# Altium schematic sheet SeccionMicrocontrolador.SchDoc
size A4
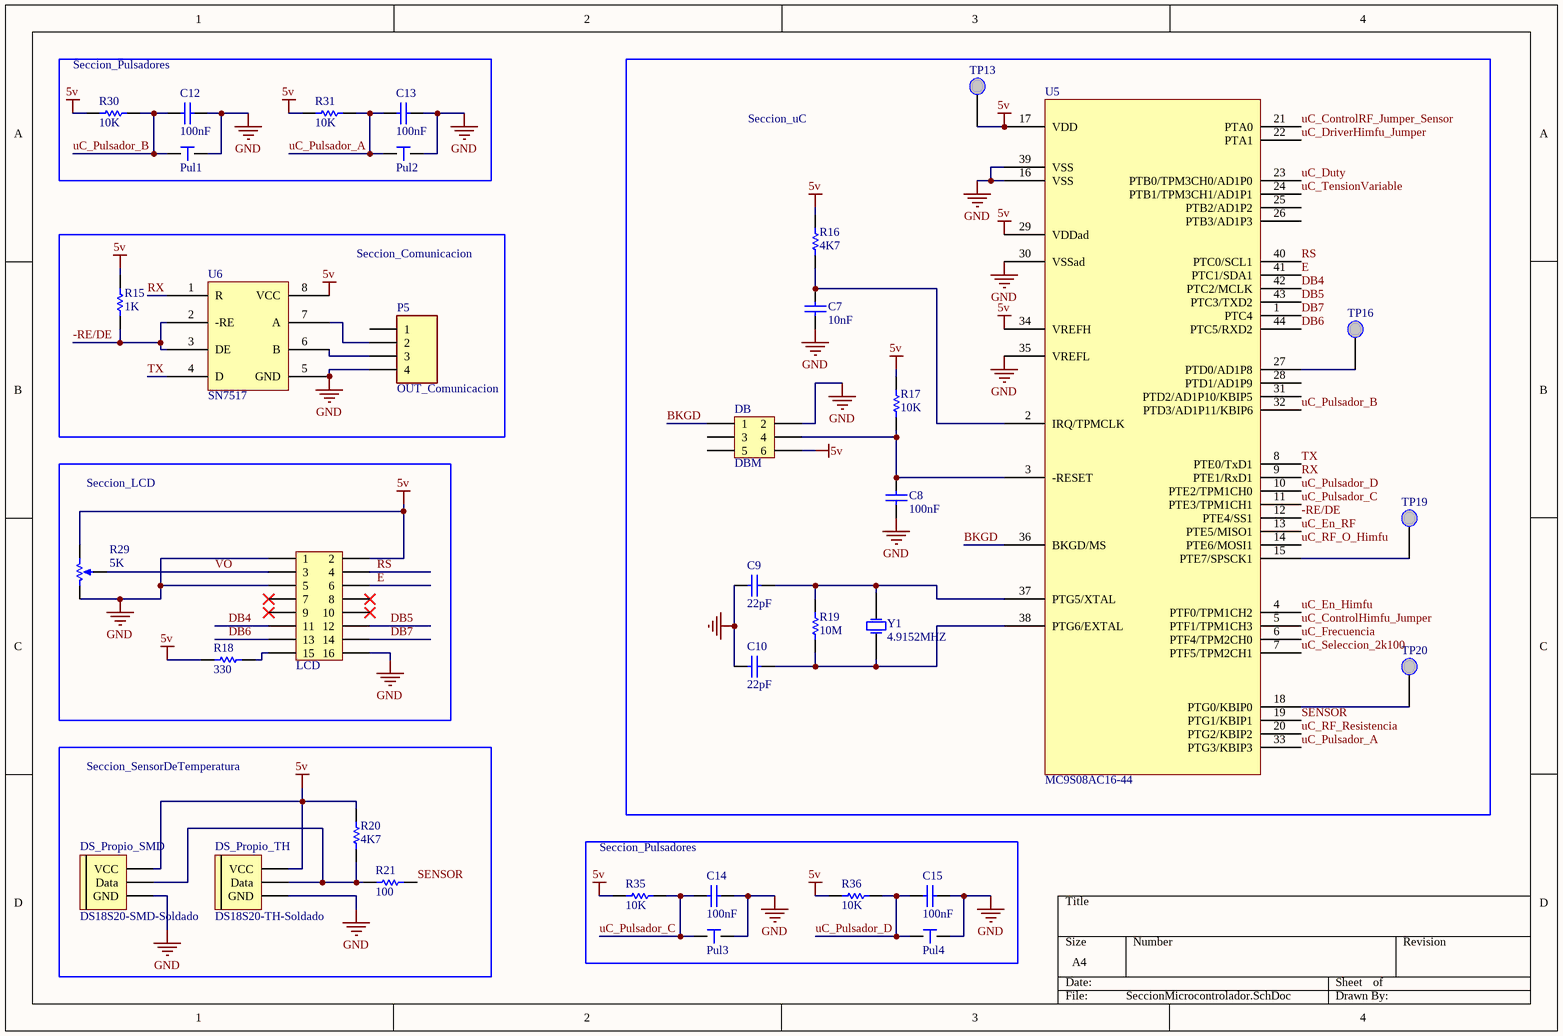
[diagram p0: SeccionMicrocontrolador.SchDoc]

## Parts
C7  10nF  [C_0805]
C8  100nF  [C_0805]
C9  22pF  [C_0805]
C10  22pF  [C_0805]
C12  100nF  [C_0805]
C13  100nF  [C_0805]
C14  100nF  [C_0805]
C15  100nF  [C_0805]
DB  DBM  [DBM]
DS_Propio_SMD  DS18S20-SMD-Soldado  [SOIC8]
DS_Propio_TH  DS18S20-TH-Soldado  [TO92]
LCD  LCD_Pines  [LCD_Pines]  (value not drawn)
P5  OUT_Comunicacion  [B4B-XH-A_3D]
Pul1  PinesParaPulsador  [Jumper-Simple]  (value not drawn)
Pul2  PinesParaPulsador  [Jumper-Simple]  (value not drawn)
Pul3  PinesParaPulsador  [Jumper-Simple]  (value not drawn)
Pul4  PinesParaPulsador  [Jumper-Simple]  (value not drawn)
R15  1K  [R_0805]
R16  4K7  [R_0805]
R17  10K  [R_0805]
R18  330  [R_0805]
R19  10M  [R_0805]
R20  4K7  [R_0805]
R21  100  [R_0805]
R29  5K  [Preset_SMD]
R30  10K  [R_0805]
R31  10K  [R_0805]
R35  10K  [R_0805]
R36  10K  [R_0805]
TP13  5V  [TP-5002]  (value not drawn)
TP16  PTD0  [TP-5002]  (value not drawn)
TP19  PTE7  [TP-5002]  (value not drawn)
TP20  PTG0  [TP-5002]  (value not drawn)
U5  MC9S08AC16-44  [QFP10x10-G44/Z14.4N]
U6  SN7517  [751-07_N]
Y1  4.9152MHZ  [XTAL_LOW]

## Blocks framed on the sheet
Seccion_Pulsadores: C12 C13 Pul1 Pul2 R30 R31
Seccion_uC: C7-C10 DB R16 R17 R19 TP13 TP16 TP19 TP20 U5 Y1
Seccion_Comunicacion: P5 R15 U6
Seccion_LCD: LCD R18 R29
Seccion_SensorDeTemperatura: DS_Propio_SMD DS_Propio_TH R20 R21
Seccion_Pulsadores: C14 C15 Pul3 Pul4 R35 R36

## Nets
5v: DB.6 DS_Propio_SMD.3(VCC) DS_Propio_TH.3(VCC) LCD.2 R15.2 R16.2 R17.2 R18.1 R20.2 R29.1(TOP_CCW) R30.2 R31.2 R35.2 R36.2 TP13.1 U5.17(VDD) U5.29(VDDad) U5.34(VREFH) U6.8(VCC)
GND: C7.1 C8.1 C9.1 C10.1 C12.1 C13.1 C14.1 C15.1 DB.2 DS_Propio_SMD.5(GND) DS_Propio_TH.1(GND) LCD.1 LCD.5 LCD.16 P5.4 Pul1.1 Pul2.1 Pul3.1 Pul4.1 R29.3(BOT_CW) U5.16(VSS) U5.30(VSSad) U5.35(VREFL) U5.39(VSS) U6.5(GND)
-RE/DE: R15.1 U5.12(PTE4/SS1) U6.2(-RE) U6.3(DE)
BKGD: DB.1 U5.36(BKGD/MS)
DB4: LCD.11 U5.42(PTC2/MCLK)
DB5: LCD.12 U5.43(PTC3/TXD2)
DB6: LCD.13 U5.44(PTC5/RXD2)
DB7: LCD.14 U5.1(PTC4)
E: LCD.6 U5.41(PTC1/SDA1)
RS: LCD.4 U5.40(PTC0/SCL1)
RX: U5.9(PTE1/RxD1) U6.1(R)
SENSOR: R21.2 U5.19(PTG1/KBIP1)
TX: U5.8(PTE0/TxD1) U6.4(D)
uC_ControlHimfu_Jumper: U5.5(PTF1/TPM1CH3)
uC_ControlRF_Jumper_Sensor: U5.21(PTA0)
uC_DriverHimfu_Jumper: U5.22(PTA1)
uC_Duty: U5.23(PTB0/TPM3CH0/AD1P0)
uC_En_Himfu: U5.4(PTF0/TPM1CH2)
uC_En_RF: U5.13(PTE5/MISO1)
uC_Frecuencia: U5.6(PTF4/TPM2CH0)
uC_Pulsador_A: C13.2 Pul2.2 R31.1 U5.33(PTG3/KBIP3)
uC_Pulsador_B: C12.2 Pul1.2 R30.1 U5.32(PTD3/AD1P11/KBIP6)
uC_Pulsador_C: C14.2 Pul3.2 R35.1 U5.11(PTE3/TPM1CH1)
uC_Pulsador_D: C15.2 Pul4.2 R36.1 U5.10(PTE2/TPM1CH0)
uC_RF_O_Himfu: U5.14(PTE6/MOSI1)
uC_RF_Resistencia: U5.20(PTG2/KBIP2)
uC_Seleccion_2k100: U5.7(PTF5/TPM2CH1)
uC_TensionVariable: U5.24(PTB1/TPM3CH1/AD1P1)
VO: LCD.3 R29.2(TAP)
NetC7_2: C7.2 R16.1 U5.2(IRQ/TPMCLK)
NetC8_2: C8.2 DB.4 R17.1 U5.3(-RESET)
NetC9_2: C9.2 R19.2 U5.37(PTG5/XTAL) Y1.2(OSC2)
NetC10_2: C10.2 R19.1 U5.38(PTG6/EXTAL) Y1.1(OSC1)
NetDS_Propio_SMD_4: DS_Propio_SMD.4(Data) DS_Propio_TH.2(Data) R20.1 R21.1
NetLCD_15: LCD.15 R18.2
NetP5_2: P5.2 U6.7(A)
NetP5_3: P5.3 U6.6(B)
NetTP16_1: TP16.1 U5.27(PTD0/AD1P8)
NetTP19_1: TP19.1 U5.15(PTE7/SPSCK1)
NetTP20_1: TP20.1 U5.18(PTG0/KBIP0)

Not connected (* = marked no-connect by the designer): DB 3 5; LCD 7* 8* 9* 10*; P5 1; U5 25(PTB2/AD1P2) 26(PTB3/AD1P3) 28(PTD1/AD1P9) 31(PTD2/AD1P10/KBIP5)

## Library data of the parts
C7 = C_10nF: CAP CER 10000PF 25V X7R 0805; Note: Footprint corresponds to dimensions for bulk cassette packaging. This case size has tightened tolerances.; Cod.Fabricante: C0805C103M3RACTU; Fabricante: KEMET; Published: 17-Jul-2002; LatestRevisionDate: 19-Mar-2004; LatestRevisionNote: Silkscreen size reduced.; DatasheetDocument: Mar-2001; PackageDocument: Mar-2001; PackageReference: 0805; Publisher: Altium Limited; ComponentLink1Description: Manufacturer Link; ComponentLink1URL: http://www.kemet.com/; ComponentLink2Description: Datasheet; ComponentLink2URL: *; Cod.Digikey: 399-9154-1-ND; Value: 10nF; DIGIKEYx100: 0.06930
C8 C12-C15 = C_100nF: CAP CER 0.1UF 25V X7R 0805; Note: Footprint corresponds to dimensions for bulk cassette packaging. This case size has tightened tolerances.; Cod.Fabricante: C0805C104M3RACTU; Fabricante: KEMET; Published: 17-Jul-2002; LatestRevisionDate: 19-Mar-2004; LatestRevisionNote: Silkscreen size reduced.; DatasheetDocument: Mar-2001; PackageDocument: Mar-2001; PackageReference: 0805; Publisher: Altium Limited; ComponentLink1Description: Manufacturer Link; ComponentLink1URL: http://www.kemet.com/; ComponentLink2Description: Datasheet; ComponentLink2URL: https://content.kemet.com/datasheets/KEM_C1002_X7R_SMD.pdf; Cod.Digikey: 399-8000-1-ND; Value: 100nF; DIGIKEYx100: 0.03160
C9 C10 = C_22pF: CAP CER 22PF 50V C0G/NP0 0805; Note: Footprint corresponds to dimensions for bulk cassette packaging. This case size has tightened tolerances.; Cod.Fabricante: C0805C220J5GACTU; Fabricante: KEMET; Published: 17-Jul-2002; LatestRevisionDate: 19-Mar-2004; LatestRevisionNote: Silkscreen size reduced.; DatasheetDocument: Mar-2001; PackageDocument: Mar-2001; PackageReference: 0805; Publisher: Altium Limited; ComponentLink1Description: Manufacturer Link; ComponentLink1URL: http://www.kemet.com/; ComponentLink2Description: Datasheet; Cod.Digikey: 399-1113-1-ND; Value: 22pF; DIGIKEYx100: 0.03100
DB = DBM: CONN HEADER VERT 6POS 2.54MM; Cod.Fabricante: 4-103186-0-03; Fabricante: TE Connectivity AMP Connectors; Cod.DigiKey: A26529-03-ND; ComponentLink1Description: Manufacturer Link; ComponentLink1URL: https://www.te.com/commerce/DocumentDelivery/DDEController?Action=srchrtrv&DocNm=103186&DocType=Customer+Drawing&DocLang=English; ComponentLink2Description: Datasheet; ComponentLink2URL: *; DatasheetVersion: *; DIGIKEYx100: 0.44760; LatestRevisionDate: *; LatestRevisionNote: *; PackageDescription: *; PackageReference: *; PackageVersion: *; Published: 29-sep-00; Publisher: Altium Limited; Value: *
DS_Propio_SMD = DS18S20-SMD-Soldado: SENSOR DIGITAL -55C-125C 8SOIC; Cod.Fabricante: DS18S20Z+; Fabricante: Maxim Integrated; Cod.DigiKey: DS18S20Z+-ND; ComponentLink1Description: Manufacturer Link; ComponentLink1URL: https://datasheets.maximintegrated.com/en/ds/DS18S20.pdf; ComponentLink2Description: Datasheet; ComponentLink2URL: *; DatasheetVersion: *; DIGIKEYx10: 3.62160; LatestRevisionDate: *; LatestRevisionNote: *; PackageDescription: *; PackageReference: 8-SOIC; PackageVersion: *; Published: 29-sep-00; Publisher: Altium Limited; Value: DS18S20
DS_Propio_TH = DS18S20-TH-Soldado: Temperature Sensor Digital, Local -55°C ~ 125°C 8 b TO-92-3; Cod.Fabricante: DS18S20+; Fabricante: Maxim Integrated; Cod.DigiKey: DS18S20+-ND; ComponentLink1Description: Manufacturer Link; ComponentLink1URL: https://datasheets.maximintegrated.com/en/ds/DS18S20.pdf; ComponentLink2Description: Datasheet; ComponentLink2URL: *; DatasheetVersion: *; DIGIKEYx10: 2.96300; LatestRevisionDate: *; LatestRevisionNote: *; PackageDescription: *; PackageReference: TO92; PackageVersion: *; Published: 29-sep-00; Publisher: Altium Limited; Value: DS18S20
LCD = LCD_Pines: CONN HEADER VERT 16POS 2.54MM; Cod.Fabricante: 5-146257-8; Fabricante: TE Connectivity AMP Connectors; Cod.DigiKey: A121470-ND; ComponentLink1Description: Manufacturer Link; ComponentLink1URL: https://www.te.com/commerce/DocumentDelivery/DDEController?Action=srchrtrv&DocNm=103186&DocType=Customer+Drawing&DocLang=English; ComponentLink2Description: Datasheet; ComponentLink2URL: *; DatasheetVersion: *; DIGIKEYx100: 0.44760; LatestRevisionDate: *; LatestRevisionNote: *; PackageDescription: *; PackageReference: *; PackageVersion: *; Published: 29-sep-00; Publisher: Altium Limited; Value: *
P5 = JST_2.5_4: CONN HEADER XH TOP 4POS 2.5MM; Cod.Fabricante: B4B-XH-A(LF)(SN); Fabricante: JST Sales America Inc.; LatestRevisionDate: 17-Jul-2002; LatestRevisionNote: Re-released for DXP Platform.; Publisher: Altium Limited; Cod.Digikey: 455-2249-ND; ComponentLink2Description: Datasheet; ComponentLink2URL: http://www.jst-mfg.com/product/pdf/eng/eXH.pdf; DIGIKEYx100: 0.1348
Pul1-Pul4 = PinesParaPulsador: CONN HEADER 2 POS 2.54; Cod.Fabricante: 61300211121; Fabricante: Wurth Electronics Inc.; Cod.DigiKey: 732-5315-ND; ComponentLink1Description: Manufacturer Link; ComponentLink1URL: https://katalog.we-online.de/em/datasheet/6130xx11121.pdf; ComponentLink2Description: Datasheet; ComponentLink2URL: *; DatasheetVersion: *; DIGIKEYx100: 0.06700; LatestRevisionDate: *; LatestRevisionNote: *; PackageDescription: *; PackageReference: *; PackageVersion: *; Published: 29-sep-00; Publisher: Altium Limited; Value: *
R15 = R_1k: RES SMD 1K OHM 1% 1/8W 0805; Cod.Fabricante: RC0805FR-071KL; Fabricante: Yageo; Published: 8-Jun-2000; LatestRevisionDate: 17-Jul-2002; LatestRevisionNote: Re-released for DXP Platform.; PackageReference: 0805; Publisher: Altium Limited; Cod.Digikey: 311-1.00KCRCT-ND; Value: 1K; DIGIKEYx100: 0.01630
R16 R20 = R_4k7: RES SMD 4K7 OHM 1% 1/8W 0805; Cod.Fabricante: RC0805FR-074K7L; Fabricante: Yageo; Published: 8-Jun-2000; LatestRevisionDate: 17-Jul-2002; LatestRevisionNote: Re-released for DXP Platform.; PackageReference: 0805; Publisher: Altium Limited; Cod.Digikey: 311-4.70KCRCT-ND; Value: 4K7; DIGIKEYx100: 0.01630
R17 R30 R31 R35 R36 = R_10k: RES SMD 10K OHM 1% 1/8W 0805; Cod.Fabricante: RC0805FR-0710KL; Fabricante: Yageo; Published: 8-Jun-2000; LatestRevisionDate: 17-Jul-2002; LatestRevisionNote: Re-released for DXP Platform.; PackageReference: 0805; Publisher: Altium Limited; Cod.Digikey: 311-10.0KCRCT-ND; Value: 10K; DIGIKEYx100: 0.01630
R18 = R_330: RES SMD 330 OHM 1% 1/8W 0805; Cod.Fabricante: RC0805FR-07330RL; Fabricante: Yageo; Published: 8-Jun-2000; LatestRevisionDate: 17-Jul-2002; LatestRevisionNote: Re-released for DXP Platform.; PackageReference: 0805; Publisher: Altium Limited; Cod.Digikey: 311-330CRCT-ND; Value: 330; DIGIKEYx100: 0.01630
R19 = R_10M: RES SMD 10M OHM 5% 1/8W 0805; Cod.Fabricante: RC0805JR-0710ML; Fabricante: Yageo; Published: 8-Jun-2000; LatestRevisionDate: 17-Jul-2002; LatestRevisionNote: Re-released for DXP Platform.; PackageReference: 0805; Publisher: Altium Limited; Cod.Digikey: 311-10MARCT-ND; Value: 10M; DIGIKEYx100: 0.01400
R21 = R_100: RES SMD 100 OHM 1% 1/8W 0805; Cod.Fabricante: RC0805FR-07100RL; Fabricante: Yageo; Published: 8-Jun-2000; LatestRevisionDate: 17-Jul-2002; LatestRevisionNote: Re-released for DXP Platform.; PackageReference: 0805; Publisher: Altium Limited; Cod.Digikey: 311-100CRCT-ND; Value: 100; DIGIKEYx100: 0.01630
R29 = Preset_5k_SMD: TRIMMER 5K OHM 0.5W GW TOP ADJ; Cod.Fabricante: 3361P-1-502GLF; Fabricante: Bourns Inc.; Published: 8-Jun-2000; LatestRevisionDate: 17-Jul-2002; LatestRevisionNote: Re-released for DXP Platform.; PackageReference: VR5; Publisher: Altium Limited; PackageDescription: Variable Resistor, Thru-Hole; 3 Leads; Series: 3361P; Cod.Digikey: 3361P-502GLFCT-ND; DIGIKEYx100: 1.01750; Value: 5K
TP13 TP16 TP19 TP20 = TestPoint: White PC Test Point, Miniature Phosphor Bronze, Silver Plating 0.040" (1.02mm) Hole Diameter Mounting Type; Cod.Fabricante: 5002; Fabricante: Keystone Electronics; Cod.DigiKey: 36-5002-ND; ComponentLink1Description: Manufacturer Link; ComponentLink1URL: http://www.keyelco.com/product-pdf.cfm?p=1311; ComponentLink2Description: Datasheet; ComponentLink2URL: *; DatasheetVersion: *; DIGIKEYx100: 0.22090; LatestRevisionDate: *; LatestRevisionNote: *; PackageDescription: *; PackageReference: *; PackageVersion: *; Published: 29-sep-00; Publisher: Altium Limited; Value: *
U5 = MC9S08AC16-44: S08 S08 Microcontroller IC 8-Bit 40MHz 16KB (16K x 8) FLASH 32-LQFP (7x7); Cod.Fabricante: MC9S08AC16CFGE; Fabricante: NXP; Cod.Digikey: MC9S08AC16CFGE-ND; ComponentLink1Description: Manufacturer Link; ComponentLink1URL: https://www.nxp.com/docs/en/data-sheet/MC9S08AC16.pdf; ComponentLink2Description: Datasheet; ComponentLink2URL: https://www.nxp.com/docs/en/data-sheet/MC9S08AC16.pdf; DatasheetVersion: Rev. 9; DIGIKEYx100: 4.1535; LatestRevisionDate: 8/2011; LatestRevisionNote: *; PackageDescription: *; PackageReference: *; PackageVersion: 44-LQFP; Published: *; Publisher: *; Value: MC9S08AC16-44
U6 = SN7517: IC TXRX DIFF BUSS 8SOIC; Cod.Fabricante: SN75176BDR; Fabricante: Texas Instruments; Cod.Digikey: 296-1275-1-ND; ComponentLink1Description: Manufacturer Link; ComponentLink1URL: http://www.ti.com/general/docs/suppproductinfo.tsp?distId=10&gotoUrl=http%3A%2F%2Fwww.ti.com%2Flit%2Fgpn%2Fsn65176b; ComponentLink2Description: Datasheet; ComponentLink2URL: http://www.ti.com/general/docs/suppproductinfo.tsp?distId=10&gotoUrl=http%3A%2F%2Fwww.ti.com%2Flit%2Fgpn%2Fsn65176b; DatasheetVersion: 1996; DIGIKEYx100: 1.55330; LatestRevisionDate: 17-jul-02; LatestRevisionNote: Re-released for DXP Platform.; PackageDescription: 8-SOIC; PackageReference: 8-SOIC; PackageVersion: 1996; Published: 29-sep-00; Publisher: Altium Limited; Value: SN7517
Y1 = XTAL_LOW: CRYSTAL 4.9152MHZ 18PF T/H; Cod.Fabricante: ATS049B-E; Fabricante: CTS-Frequency Controls; Cod.Digikey: CTX914-ND; ComponentLink1Description: *; ComponentLink1URL: *; ComponentLink2Description: Datasheet; ComponentLink2URL: https://www.ctscorp.com/wp-content/uploads/ATS-ATSSM.pdf; DatasheetVersion: Rev. M; DIGIKEYx100: 0.27000; LatestRevisionDate: *; LatestRevisionNote: *; PackageDescription: *; PackageReference: HC-49/US; PackageVersion: *; Published: *; Publisher: *; Value: 4.9152MHz